# EAGLE design Elektronischer_Wuerfel (EAGLE 5.12)
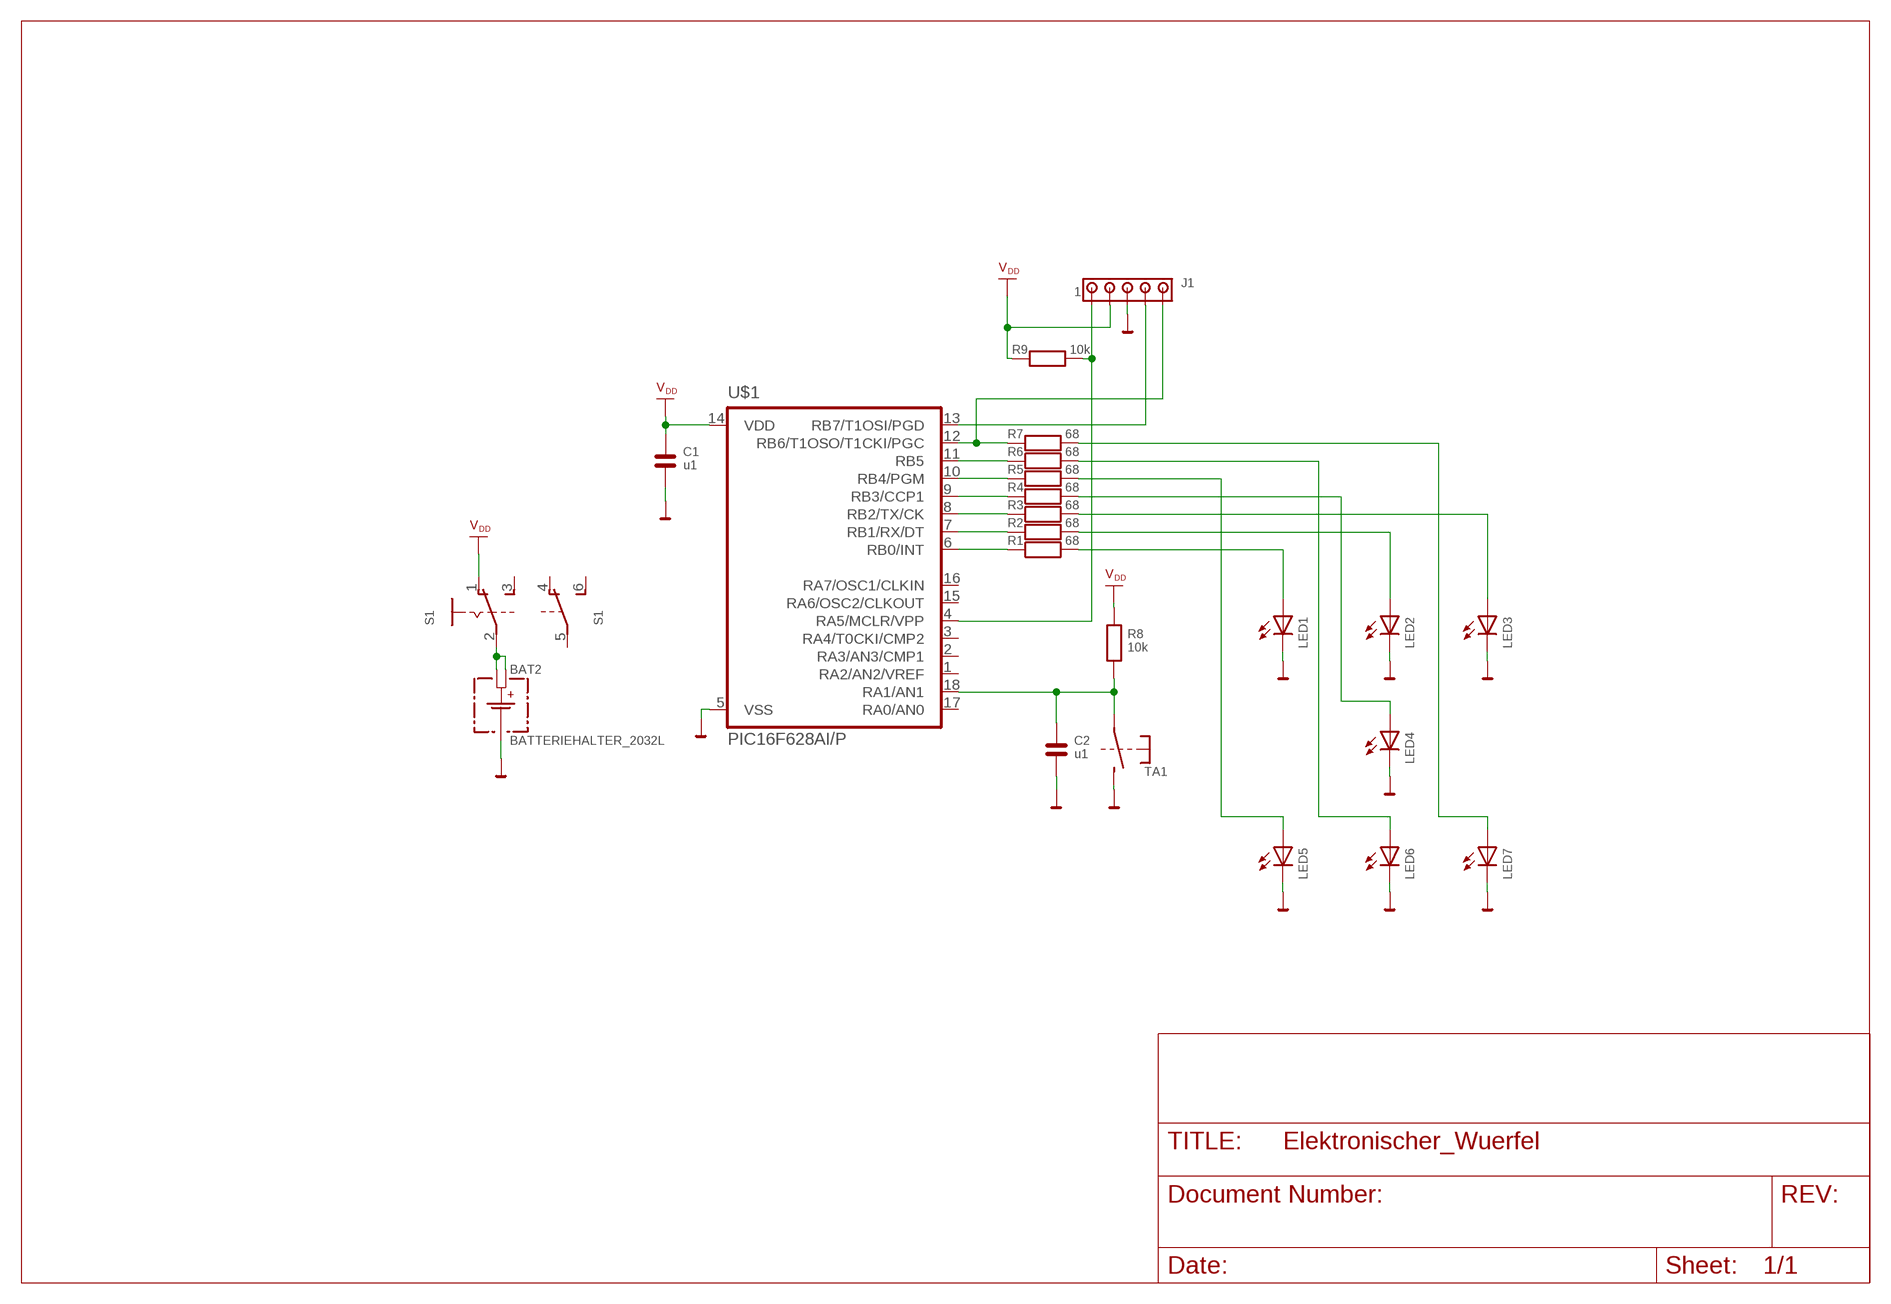
[diagram p0: schematic, sheet 1]

## Parts
BAT2  BATTERIEHALTER_2032L  [HU2032-LF]
C1  u1  C-EU050-025X075  [C050-025X075]
C2  u1  C-EU050-025X075  [C050-025X075]
J1  MTA05-100  [10X05MTA]
LED1  LED3MM  [LED3MM]
LED2  LED3MM  [LED3MM]
LED3  LED3MM  [LED3MM]
LED4  LED3MM  [LED3MM]
LED5  LED3MM  [LED3MM]
LED6  LED3MM  [LED3MM]
LED7  LED3MM  [LED3MM]
R1  68  R-EU_0207/12MM-5E  [0207/12]
R2  68  R-EU_0207/12MM-5E  [0207/12]
R3  68  R-EU_0207/12MM-5E  [0207/12]
R4  68  R-EU_0207/12MM-5E  [0207/12]
R5  68  R-EU_0207/12MM-5E  [0207/12]
R6  68  R-EU_0207/12MM-5E  [0207/12]
R7  68  R-EU_0207/12MM-5E  [0207/12]
R8  10k  R-EU_0207/12MM-5E  [0207/12]
R9  10k  R-EU_0207/12MM-5E  [0207/12]
S1  A68-A31  [A68-A31]
TA1  PRINTTASTER-10°2  [PRINTTASTER-10^2]
U$1  PIC16F628AI/P  [DIL18]

## Nets
GND: BAT2.- C1.2 C2.2 J1.3 LED1.K(C) LED2.K(C) LED3.K(C) LED4.K(C) LED5.K(C) LED6.K(C) LED7.K(C) TA1.2(S) U$1.5(VSS)
N$1: R1.1 U$1.6(RB0/INT)
N$2: R2.1 U$1.7(RB1/RX/DT)
N$3: R3.1 U$1.8(RB2/TX/CK)
N$4: R4.1 U$1.9(RB3/CCP1)
N$5: R5.1 U$1.10(RB4/PGM)
N$6: R6.1 U$1.11(RB5)
N$7: J1.5 R7.1 U$1.12(RB6/T1OSO/T1CKI/PGC)
N$8: C2.1 R8.1 TA1.1(P) U$1.18(RA1/AN1)
N$9: LED1.A R1.2
N$10: LED2.A R2.2
N$11: LED3.A R3.2
N$12: LED4.A R4.2
N$13: LED5.A R5.2
N$14: LED6.A R6.2
N$15: LED7.A R7.2
N$17: J1.4 U$1.13(RB7/T1OSI/PGD)
N$18: J1.1 R9.2 U$1.4(RA5/MCLR/VPP)
N$19: BAT2.1+ BAT2.2+ S1.2(A:P)
VDD: C1.1 J1.2 R8.2 R9.1 S1.1(A:O) U$1.14(VDD)
Unconnected: S1.3(A:S) S1.4(B:O) S1.5(B:P) S1.6(B:S) U$1.1(RA2/AN2/VREF) U$1.2(RA3/AN3/CMP1) U$1.3(RA4/T0CKI/CMP2) U$1.15(RA6/OSC2/CLKOUT) U$1.16(RA7/OSC1/CLKIN) U$1.17(RA0/AN0)

## Notes on the sheet
- Der Schalter ist vielleicht etwas overkill,
- aber wir haben den lagernd und in der HTL-Bibliothek.

## Library data of the parts
BAT2 = wis_diverses:BATTERIEHALTER_2032: Batteriehalter printbar für CR2032 und CR2025 Renata-Batteries HU2032-LF; Arikelnummer: 701106 Goobay Batteriehalter stehend für Leiterplattenmontage; Artikelnummer: 46159
C1 C2 = HTL-RCL:C-EU: CAPACITOR, European symbol
J1 = HTL-con-amp:MTA05-100: AMP connector
LED1-LED7 = HTL-LED:LED: LED OSRAM: - CHIPLED LG R971, LG N971, LY N971, LG Q971, LY Q971, LO R971, LY R971 LH N974, LH R974 LS Q976, LO Q976, LY Q976 LO Q996 - Hyper CHIPLED LW Q18S LB Q993, LB Q99A, LB R99A - SideLED LS A670, LO A670, LY A670, LG A670, LP A670 LB A673, LV A673, LT A673, LW A673 LH A674 LY A675 LS A676, LA A676, LO A676, LY A676, LW A676 LS A679, LY A679, LG A679 - Hyper Micro SIDELED® LS Y876, LA Y876, LO Y876, LY Y876 LT Y87S - SmartLED LW L88C, LW L88S LB L89C, LB L89S, LG L890 LS L89K, LO L89K, LY L89K LS L896, LA L896, LO L896, LY L896 - TOPLED LS T670, LO T670, LY T670, LG T670, LP T670 LSG T670, LSP T670, LSY T670, LOP T670, LYG T670 LG T671, LOG T671, LSG T671 LB T673, LV T673, LT T673, LW T673 LH T674 LS T676, LA T676, LO T676, LY T676, LB T676, LH T676, LSB T676, LW T676 LB T67C, LV T67C, LT T67C, LS T67K, LO T67K, LY T67K, LW E67C LS E67B, LA E67B, LO E67B, LY E67B, LB E67C, LV E67C, LT E67C LW T67C LS T679, LY T679, LG T679 LS T770, LO T770, LY T770, LG T770, LP T770 LB T773, LV T773, LT T773, LW T773 LH T774 LS E675, LA E675, LY E675, LS T675 LS T776, LA T776, LO T776, LY T776, LB T776 LHGB T686 LT T68C, LB T68C - Hyper Mini TOPLED® LB M676 - Mini TOPLED Santana® LG M470 LS M47K, LO M47K, LY M47K Source: http://www.osram.convergy.de LUXEON: - LUMILED® LXK2-PW12-R00, LXK2-PW12-S00, LXK2-PW14-U00, LXK2-PW14-V00 LXK2-PM12-R00, LXK2-PM12-S00, LXK2-PM14-U00 LXK2-PE12-Q00, LXK2-PE12-R00, LXK2-PE12-S00, LXK2-PE14-T00, LXK2-PE14-U00 LXK2-PB12-K00, LXK2-PB12-L00, LXK2-PB12-M00, LXK2-PB14-N00, LXK2-PB14-P00, LXK2-PB14-Q00 LXK2-PR12-L00, LXK2-PR12-M00, LXK2-PR14-Q00, LXK2-PR14-R00 LXK2-PD12-Q00, LXK2-PD12-R00, LXK2-PD12-S00 LXK2-PH12-R00, LXK2-PH12-S00 LXK2-PL12-P00, LXK2-PL12-Q00, LXK2-PL12-R00 Source: www.luxeon.com KINGBRIGHT: KA-3528ASYC Source: www.kingbright.com
R1-R9 = HTL-RCL:R-EU_: Resistor, European symbol
S1 = HTL-Switch:A68-A31: SLIDING SWITCH Siemens, distributor Buerklin, 11G766
TA1 = HTL-Switch-misc:PRINTTASTER-10°2: Printtaster 10°2 mm Kantenlänge, Bohrung:1,1mm, Höhe ab Print: 15mm Conrad-Best.-#: 707724
U$1 = microchip-5:PIC16F628*: MICROCONTROLLER PIC16F628(A) 16 I/O One 16-bit timer Two 8-bit timer Two comparators USART CCP/PWM Precision 4 MHz internal oscillator 2k Program Flash memory 224 bytes SRAM 128 bytes EEPROM

## Board
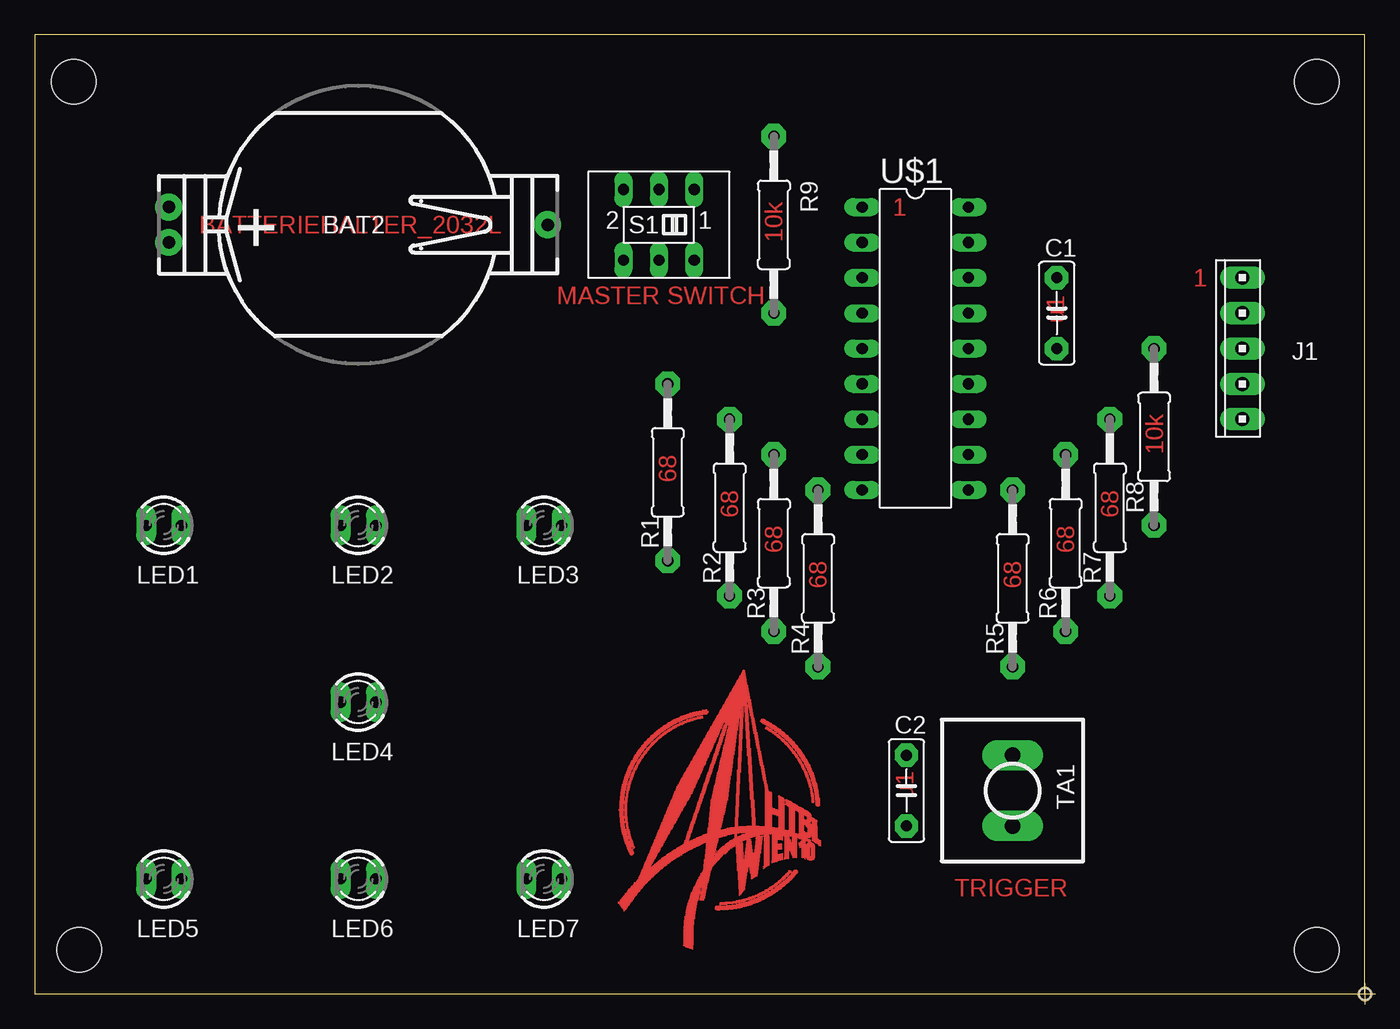
[diagram p1: board, top side]
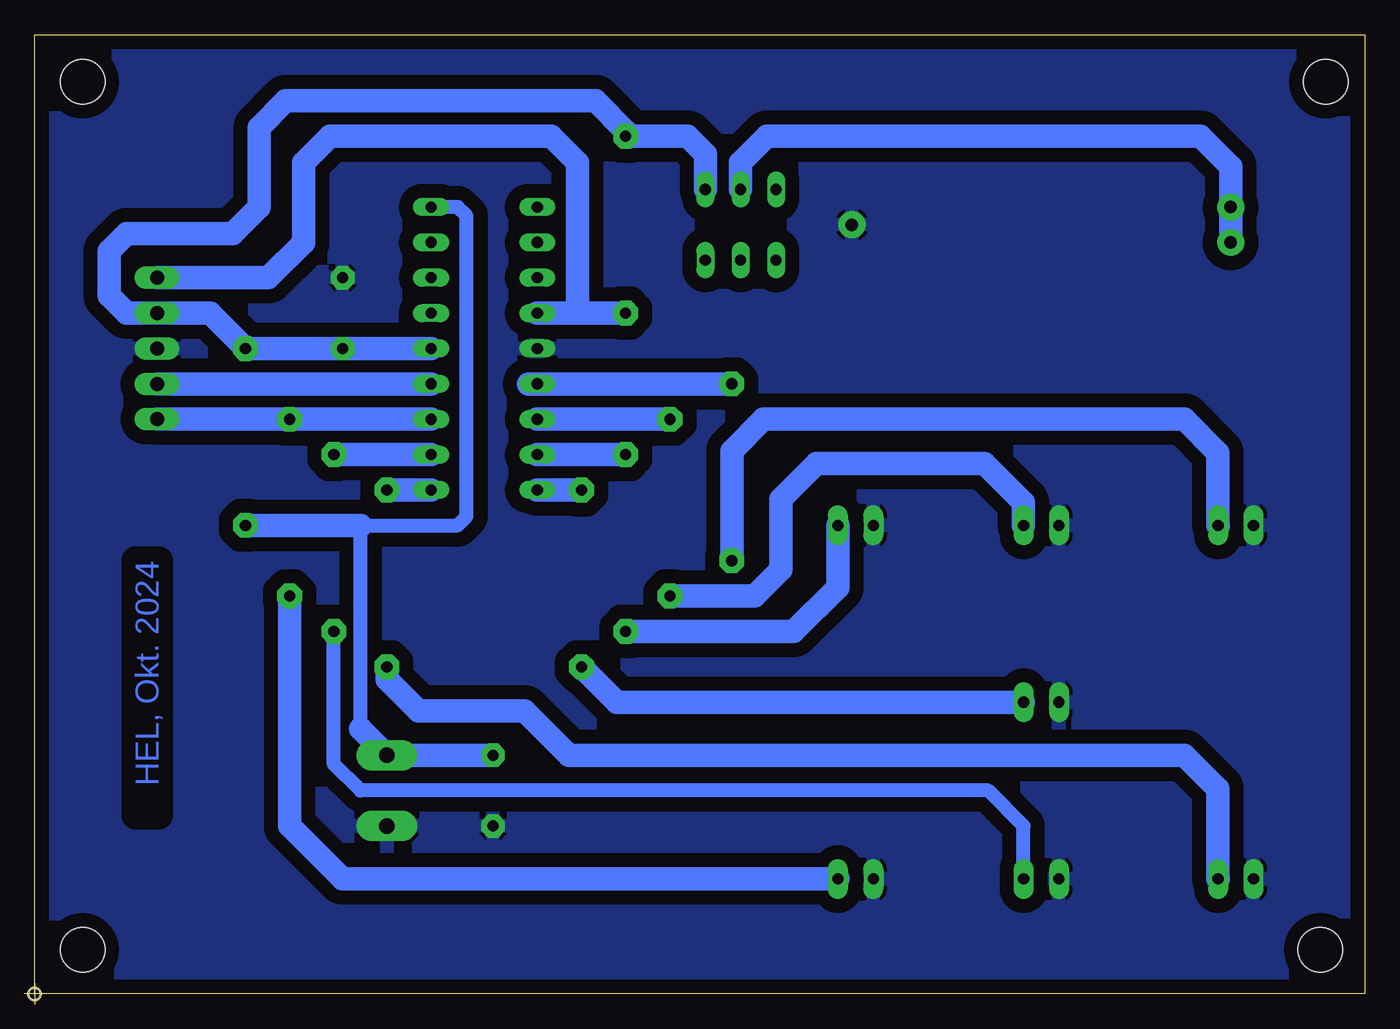
[diagram p2: board, bottom side, seen from below]

Size 95.5 x 68.89 mm. Coordinates in mm from the lower left corner, seen from the top.
Outline: 0,0 95.5,0 95.5,68.89 0,68.89 0,0
Copper layers (1*16): Top 0.035mm / dielectric 1.5mm / Bottom 0.035mm
Design rules "default": minimum track width 25mil, minimum drill 24mil, track to track 40mil, track to pad 40mil, pad to pad 25mil, via to via 25mil, smd to smd 12mil, copper to edge 40mil, drill to drill 8mil, minimum pad ring 10mil, minimum via ring 15mil, stop-mask expansion 0mil, vias tented up to drill 0mil, thermal gap 10mil
Holes 3.2 mm at 2.81,65.5 92.08,65.5 92.08,3.17 3.17,3.17

### Footprints (pad centres in the part's own frame; a part is rotated, then mirrored left to right if it is on the bottom)
HU2032-LF = drill 0.9 pad 1.93 round: 1+ -13.6,1.27; 2+ -13.6,-1.27; - 13.6,0
C050-025X075 = drill 0.8 pad 1.676 octagon: 1 -2.54,0; 2 2.54,0
10X05MTA = drill 1 long: 1 5.08,0; 2 2.54,0; 3 0,0; 4 -2.54,0; 5 -5.08,0
LED3MM = drill 0.8 pad 1.422 long: A -1.27,0; K 1.27,0
0207/12 = drill 0.8 pad 1.778 octagon: 1 -6.35,0; 2 6.35,0
A68-A31 = drill 0.8 long: 1 -2.54,-2.54; 2 0,-2.54; 3 2.54,-2.54; 4 -2.54,2.54; 5 0,2.54; 6 2.54,2.54
PRINTTASTER-10^2 = drill 1.1 pad 2.184 long: 1 -2.54,0; 2 2.54,0
DIL18 = drill 0.8 pad 1.27 long: 1 -10.16,-3.81; 2 -7.62,-3.81; 3 -5.08,-3.81; 4 -2.54,-3.81; 5 0,-3.81; 6 2.54,-3.81; 7 5.08,-3.81; 8 7.62,-3.81; 9 10.16,-3.81; 10 10.16,3.81; 11 7.62,3.81; 12 5.08,3.81; 13 2.54,3.81; 14 0,3.81; 15 -2.54,3.81; 16 -5.08,3.81; 17 -7.62,3.81; 18 -10.16,3.81
NULLPUNKT = hole 0.8: 0,0

### Placement (x,y rotation side)
BAT2  23.23,55.24 0 top
C1  73.39,48.9 90 top
C2  62.59,14.61 270 top
J1  86.72,46.35 90 top
LED1  9.26,33.66 180 top
LED2  23.23,33.66 180 top
LED3  36.56,33.66 180 top
LED4  23.23,20.95 180 top
LED5  9.26,8.26 180 top
LED6  23.23,8.26 180 top
LED7  36.56,8.26 180 top
R1  45.45,37.47 270 top
R2  49.9,34.92 270 top
R3  53.07,32.38 270 top
R4  56.24,29.84 270 top
R5  70.22,29.84 270 top
R6  74.03,32.38 270 top
R7  77.2,34.92 270 top
R8  80.38,40.01 90 top
R9  53.07,55.24 270 top
S1  44.81,55.24 180 top
TA1  70.22,14.61 270 top
U$1  63.23,46.35 270 top
U$2  [NULLPUNKT]  95.52,0 0 top
U$3  [HTL20TOP]  46.99,3.17 0 top

### Tracks (layer width: path | path; a pad name or v marks a point on that pad's centre or on a via)
GND
  pour Bottom (isolate 1.016): 0,69.22 95.52,69.22 95.52,0 0,0
N$1
  Bottom 1.676: R1.1 U$1.6 60.05,43.81
N$2
  Bottom 1.676: R2.1 U$1.7
N$3
  Bottom 1.676: R3.1 U$1.8
N$4
  Bottom 1.676: R4.1 U$1.9
N$5
  Bottom 1.676: U$1.10 R5.1
N$6
  Bottom 1.676: U$1.11 R6.1
N$7
  Bottom 1.676: U$1.12 R7.1 J1.5
N$8
  Bottom 1.016: 72.12,19.05 72.12,33.66 65.14,33.66 64.5,34.29 64.5,55.88 65.14,56.52 U$1.18
  Bottom 1.676: 72.12,19.05 TA1.1 C2.1 | 72.12,33.66 R8.1
N$9
  Bottom 1.676: R1.2 45.45,39.01 43.18,41.27 12.95,41.27 10.54,38.86 10.54,33.67 LED1.A
N$10
  Bottom 1.676: LED2.A 24.5,35.29 27.3,38.1 39.37,38.1 41.91,35.56 41.91,30.48 43.81,28.57 R2.2
N$11
  Bottom 1.676: LED3.A 37.83,29.21 41.01,26.04 R3.2
N$12
  Bottom 1.676: LED4.A 53.7,20.95 R4.2
N$13
  Bottom 1.676: R5.2 70.22,22.59 67.94,20.32 60.33,20.32 57.15,17.14 12.95,17.14 10.54,14.73 10.54,8.27 LED5.A
N$14
  Bottom 1.016: R6.2 74.03,16.51 72.12,14.61 27.04,14.61 24.5,12.06 LED6.A
N$15
  Bottom 1.676: LED7.A 73.39,8.26 77.2,12.06 R7.2
N$17
  Bottom 1.676: U$1.13 J1.4
N$18
  Bottom 1.676: R9.2 56.52,48.9 | 56.52,48.9 U$1.4 | J1.1 78.74,51.44 76.2,53.98 76.2,59.69 74.3,61.59 58.42,61.59 56.52,59.69 56.52,48.9
N$19
  Bottom 1.676: BAT2.2+ BAT2.1+ 9.62,59.42 11.79,61.59 42.91,61.59 44.81,59.69 S1.2
VDD
  Bottom 1.676: U$1.14 C1.1 R8.2 82.92,48.9 J1.2 88.9,48.9 90.17,50.16 90.17,53.34 88.9,54.61 81.28,54.61 79.38,56.52 79.38,62.23 77.47,64.14 55.24,64.14 53.07,61.96 R9.1 48.62,61.59 47.35,60.33 S1.1

### Text on the board
Top: 1 | 1 | MASTER SWITCH | TRIGGER
Bottom: HEL, Okt. 2024